# Altium schematic sheet MCP23017.SchDoc
size B
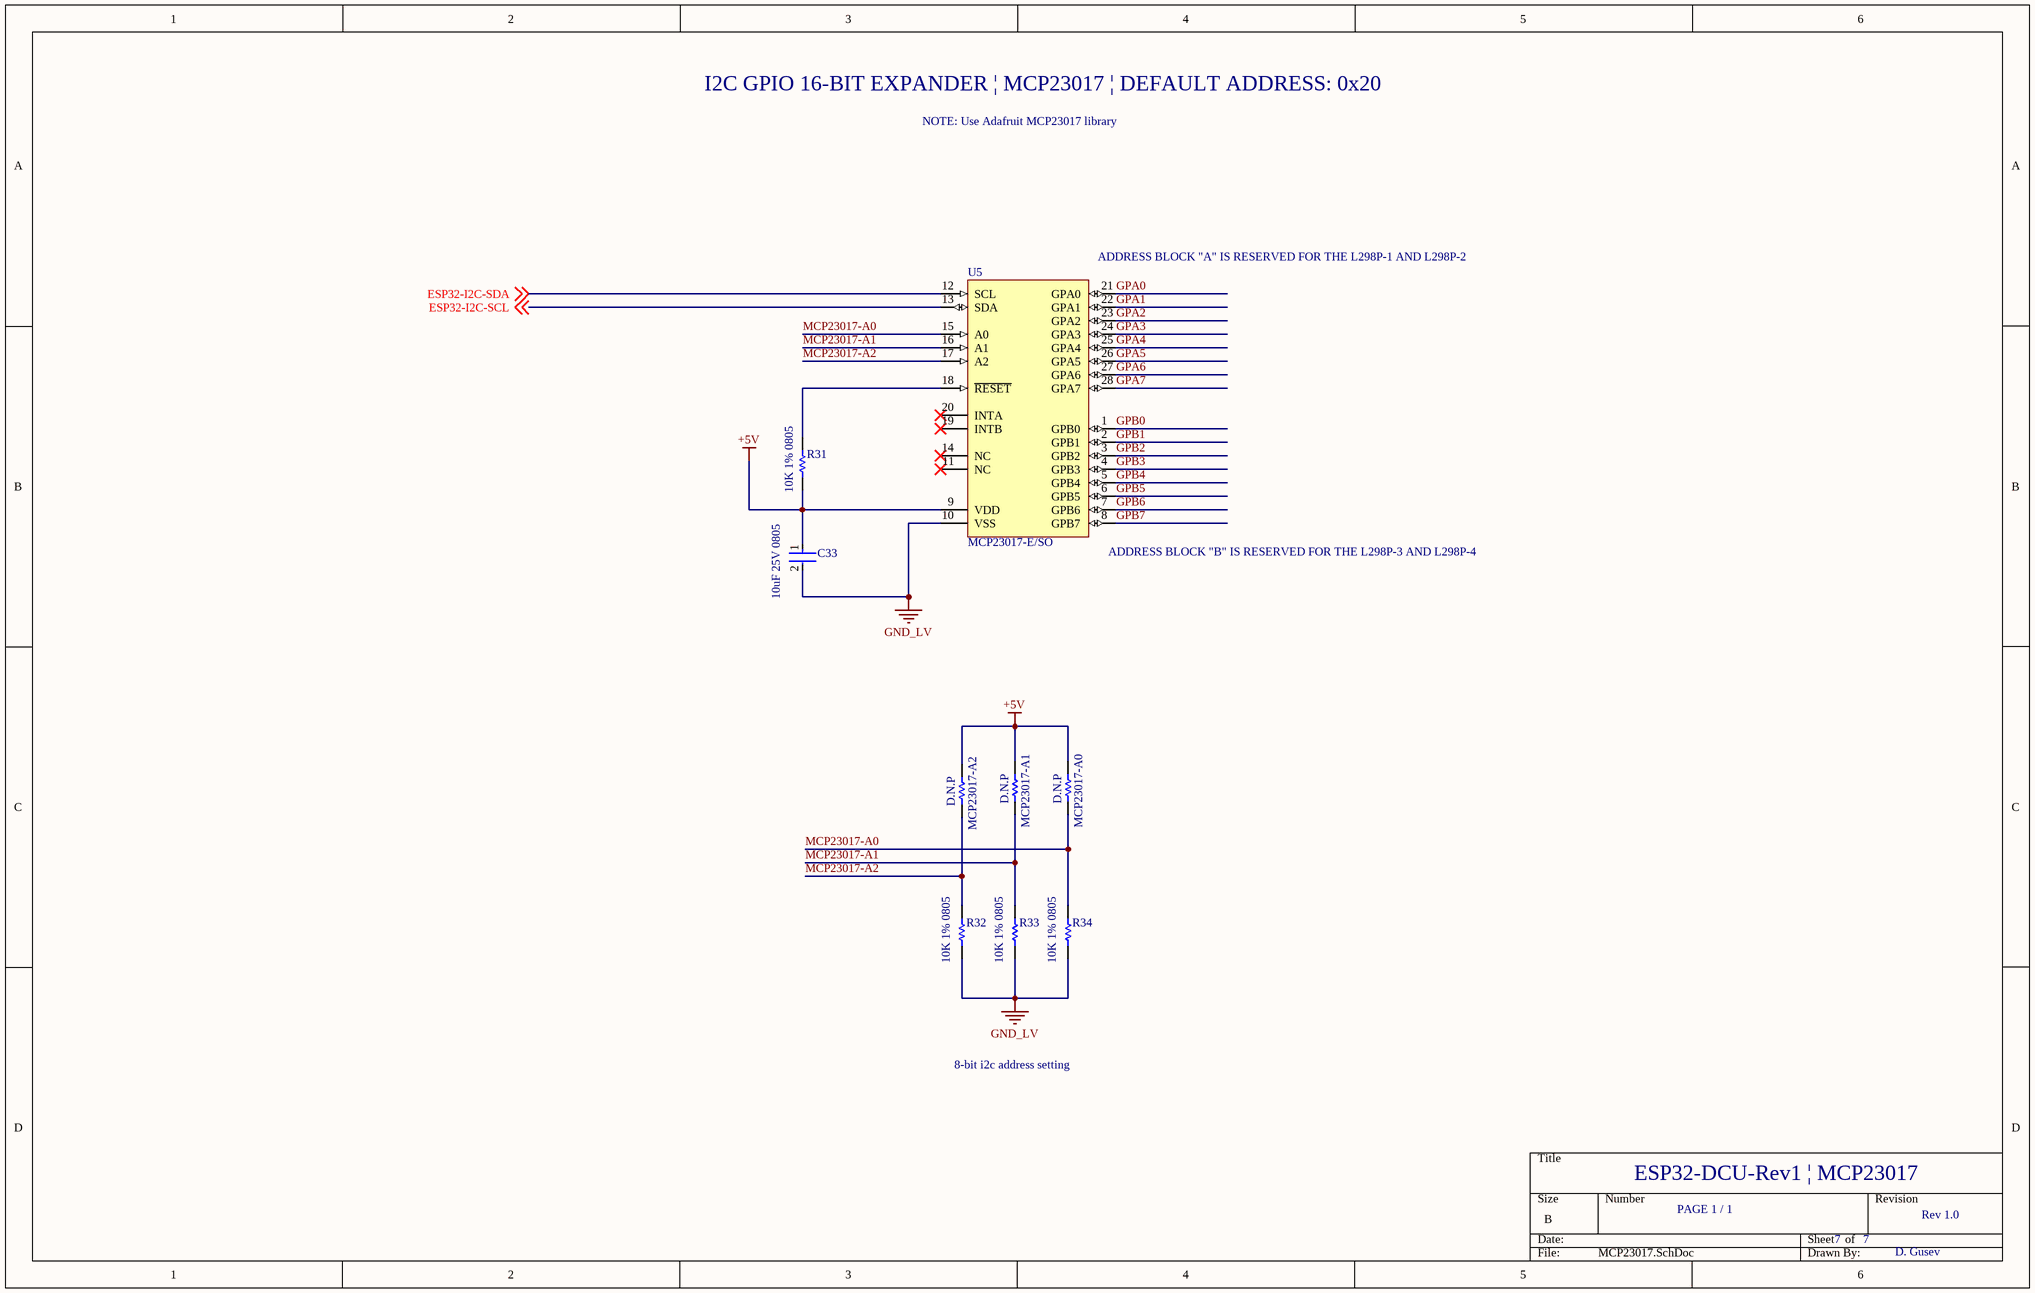
[diagram p0: MCP23017.SchDoc]

## Parts
C33  10uF 25V 0805  [FP-GRM21B-0_15-IPC_B]
MCP23017-A0  D.N.P  [RESC2013X60X35LL10T20]
MCP23017-A1  D.N.P  [RESC2013X60X35LL10T20]
MCP23017-A2  D.N.P  [RESC2013X60X35LL10T20]
R31  10K 1% 0805  [RESC2013X60X35ML10T20]
R32  10K 1% 0805  [RESC2013X60X35ML10T20]
R33  10K 1% 0805  [RESC2013X60X35ML10T20]
R34  10K 1% 0805  [RESC2013X60X35ML10T20]
U5  MCP23017-E/SO  [SOIC-SO28_N]

## Nets
+5V: C33.1 MCP23017-A0.2 MCP23017-A1.2 MCP23017-A2.2 R31.1 U5.9(VDD)
GND_LV: C33.2 R32.2 R33.2 R34.2 U5.10(VSS)
ESP32-I2C-SCL: U5.13(SDA) ; off-sheet ESP32-I2C-SCL
ESP32-I2C-SDA: U5.12(SCL) ; off-sheet ESP32-I2C-SDA
GPA0: U5.21(GPA0)
GPA1: U5.22(GPA1)
GPA2: U5.23(GPA2)
GPA3: U5.24(GPA3)
GPA4: U5.25(GPA4)
GPA5: U5.26(GPA5)
GPA6: U5.27(GPA6)
GPA7: U5.28(GPA7)
GPB0: U5.1(GPB0)
GPB1: U5.2(GPB1)
GPB2: U5.3(GPB2)
GPB3: U5.4(GPB3)
GPB4: U5.5(GPB4)
GPB5: U5.6(GPB5)
GPB6: U5.7(GPB6)
GPB7: U5.8(GPB7)
MCP23017-A0: MCP23017-A0.1 R34.1 U5.15(A0)
MCP23017-A1: MCP23017-A1.1 R33.1 U5.16(A1)
MCP23017-A2: MCP23017-A2.1 R32.1 U5.17(A2)
NetR31_2: R31.2 U5.18(~{RESET})

Not connected (* = marked no-connect by the designer): U5 11(NC)* 14(NC)* 19(INTB)* 20(INTA)*

## Notes on the sheet
- I2C GPIO 16-BIT EXPANDER | MCP23017 | DEFAULT ADDRESS: 0x20
- NOTE: Use Adafruit MCP23017 library
- (near U5) ADDRESS BLOCK "A" IS RESERVED FOR THE L298P-1 AND L298P-2
- (near U5) ADDRESS BLOCK "B" IS RESERVED FOR THE L298P-3 AND L298P-4
- 8-bit i2c address setting
- ESP32-DCU-Rev1 | MCP23017
- PAGE 1 / 1
- 7
- Rev 1.0
- D. Gusev

## Library data of the parts
C33 = CMP-2007-03541-2: Chip Multilayer Ceramic Capacitors for General Purpose, 0805, 10uF, X5R, 15%, 10%, 25V; Length: 2mm; Depth: 1.25mm; Termination: SMD/SMT; Voltage: 25V; Height: 1.25mm; Material: Ceramic; Thickness: 0.053inch; Radiation Hardening: No; Min Operating Temperature: -55°C; Width: 0.049inch; Package Quantity: 1; Mount: Surface Mount; Dielectric: X5R; Packaging: Tape and Reel; Capacitance: 10uF; Voltage Rating (DC): 25V; Lead Free: Lead Free; Max Operating Temperature: 85°C; Case Code (Imperial): 0805; Case/Package: 0805; Tolerance: 10%; Voltage Rating: 25V; Case Code (Metric): 2012
MCP23017-A0-MCP23017-A2 = CMP-1659-00014-4: Chip Resistor, 1 Ohm, +/- 1%, 125 mW, -55 to 155 degC, 0805 (2012 Metric), RoHS, Tape and Reel; Manufacturer: Yageo; Voltage Rating: 150 V; REACH SVHC: No SVHC; Mounting Technology: Surface Mount; RoHSCompliant: true; Packaging: Tape and Reel; ComponentLink2URL: http://www.yageo.com/documents/recent/PYu-RC_Group_51_RoHS_L_04.pdf; Pins: 2; Package Quantity: 5000; DatasheetVersion: Rev. 4, 02/2016; Mount: Surface Mount; Max Operating Temperature: 155 degC; PackageDescription: 2-Pin Surface Mounted Device, Body 2 x 1.25 mm; PackageReference: 0805; Length: 2 mm; Min Operating Temperature: -55 degC; ComponentLink1URL: http://www.yageo.com/; Height: 0.5 mm; ComponentLink1Description: Manufacturer URL; ComponentLink2Description: Datasheet
R31-R34 = CMP-2000-05025-1: Chip Resistor, 10 KOhm, +/- 5%, 0.125 W, -55 to 155 degC, 0805 (2012 Metric), RoHS, Tape and Reel; Manufacturer: Yageo; Resistor Element Type: ThickFilm; Voltage Rating: 150V; Product Range: RCSeries; SVHC: ToBeAdvised; Resistor Case Style: 0805[2012Metric]; Temperature Coefficient: ±100ppm/degC; Power Rating: 250mW; Resistance: 10kohm; Automotive Qualification Standard: -; Datasheet Version: REV. 2, 09/2004; Packaging: CutTape; Resistance Tolerance: ±5%; MSL: MSL1-Unlimited; Manufacturer URL: http://www.yageo.com/; Datasheet URL: http://www.yageo.ru/pdf/RC0805.pdf; Package Description: 2-Pin Surface Mounted Device, Body 2 x 1.25 mm; Package Reference: 805
U5 = CMP-0186-00161-2: 16-Bit I/O Expander with Serial Interface, 28-Pin SOIC, Extended Temperature; PackageReference: SOIC-SO28; ComponentLink2URL: http://ww1.microchip.com/downloads/en/DeviceDoc/21952b.pdf; PackageVersion: revBB, Aug-2009; ComponentLink1URL: http://www.microchip.com/; Code_JEDEC: MS-013; ComponentLink2Description: Datasheet; DatasheetVersion: revB, Feb-2007; PackageDescription: 28-Lead Plastic Small Outline (SO) - Wide 7.50mm Body [SOIC]; ComponentLink3Description: Package Specification; ComponentLink1Description: Manufacturer URL; RevisionNote: URLs added.; ComponentLink3URL: http://www.microchip.com/stellent/groups/techpub_sg/documents/packagingspec/en012702.pdf